# Altium schematic sheet Arduino_Header.SchDoc
size B
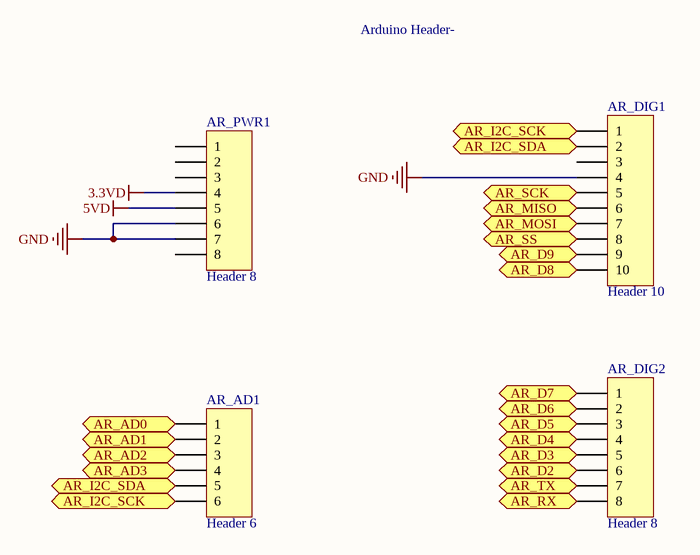
[diagram p0: Arduino_Header.SchDoc]

## Parts
AR_AD1  Header 6  [HDR1X6]
AR_DIG1  Header 10  [HDR1X10]
AR_DIG2  Header 8  [HDR1X8]
AR_PWR1  Header 8  [HDR1X8]

## Ports
AR_AD0 (in), AR_AD1 (in), AR_AD2 (in), AR_AD3 (in), AR_D2, AR_D3, AR_D4, AR_D5, AR_D6, AR_D7, AR_D8, AR_D9, AR_I2C_SCK (in), AR_I2C_SDA (in), AR_MISO (in), AR_MOSI (in), AR_RX (in), AR_SCK (in), AR_SS (in), AR_TX (out)

## Nets
3.3VD: AR_PWR1.4
5VD: AR_PWR1.5
GND: AR_DIG1.4 AR_PWR1.6 AR_PWR1.7
AR_AD0: AR_AD1.1 ; port AR_AD0
AR_AD1: AR_AD1.2 ; port AR_AD1
AR_AD2: AR_AD1.3 ; port AR_AD2
AR_AD3: AR_AD1.4 ; port AR_AD3
AR_D2: AR_DIG2.6 ; port AR_D2
AR_D3: AR_DIG2.5 ; port AR_D3
AR_D4: AR_DIG2.4 ; port AR_D4
AR_D5: AR_DIG2.3 ; port AR_D5
AR_D6: AR_DIG2.2 ; port AR_D6
AR_D7: AR_DIG2.1 ; port AR_D7
AR_D8: AR_DIG1.10 ; port AR_D8
AR_D9: AR_DIG1.9 ; port AR_D9
AR_I2C_SCK: AR_AD1.6 AR_DIG1.1 ; port AR_I2C_SCK
AR_I2C_SDA: AR_AD1.5 AR_DIG1.2 ; port AR_I2C_SDA
AR_MISO: AR_DIG1.6 ; port AR_MISO
AR_MOSI: AR_DIG1.7 ; port AR_MOSI
AR_RX: AR_DIG2.8 ; port AR_RX
AR_SCK: AR_DIG1.5 ; port AR_SCK
AR_SS: AR_DIG1.8 ; port AR_SS
AR_TX: AR_DIG2.7 ; port AR_TX

Not connected (* = marked no-connect by the designer): AR_DIG1 3; AR_PWR1 1 2 3 8

## Notes on the sheet
- Arduino Header-
- ESE
- is the sole property of ESE. Any reproduction
- The Information Contained in this drawing
- Schematic P/N and Name
- Sheet Name
- 299 Doon Valley Drive
- Kitchener, ON N2G 4M4
- Canada
- Approved
- in part or in whole without the written
- permission of ESE is strictly prohibited.
- APPROVALS
- DATE
- Size
- Scale
- B
- NTS
- Bare PCB P/N
- Date
- Sheet
- Rev.
- Checked
- Engineer
- of

## Library data of the parts
AR_AD1 = Header 6: Header, 6-Pin; LatestRevisionDate: 17-Jul-2002; LatestRevisionNote: Re-released for DXP Platform.; Publisher: Altium Limited
AR_DIG1 = Header 10: Header, 10-Pin; LatestRevisionDate: 17-Jul-2002; LatestRevisionNote: Re-released for DXP Platform.; Publisher: Altium Limited
AR_DIG2 AR_PWR1 = Header 8: Header, 8-Pin; LatestRevisionDate: 17-Jul-2002; LatestRevisionNote: Re-released for DXP Platform.; Publisher: Altium Limited